# EAGLE design Video_critter_mini_v01 (EAGLE 6.1)
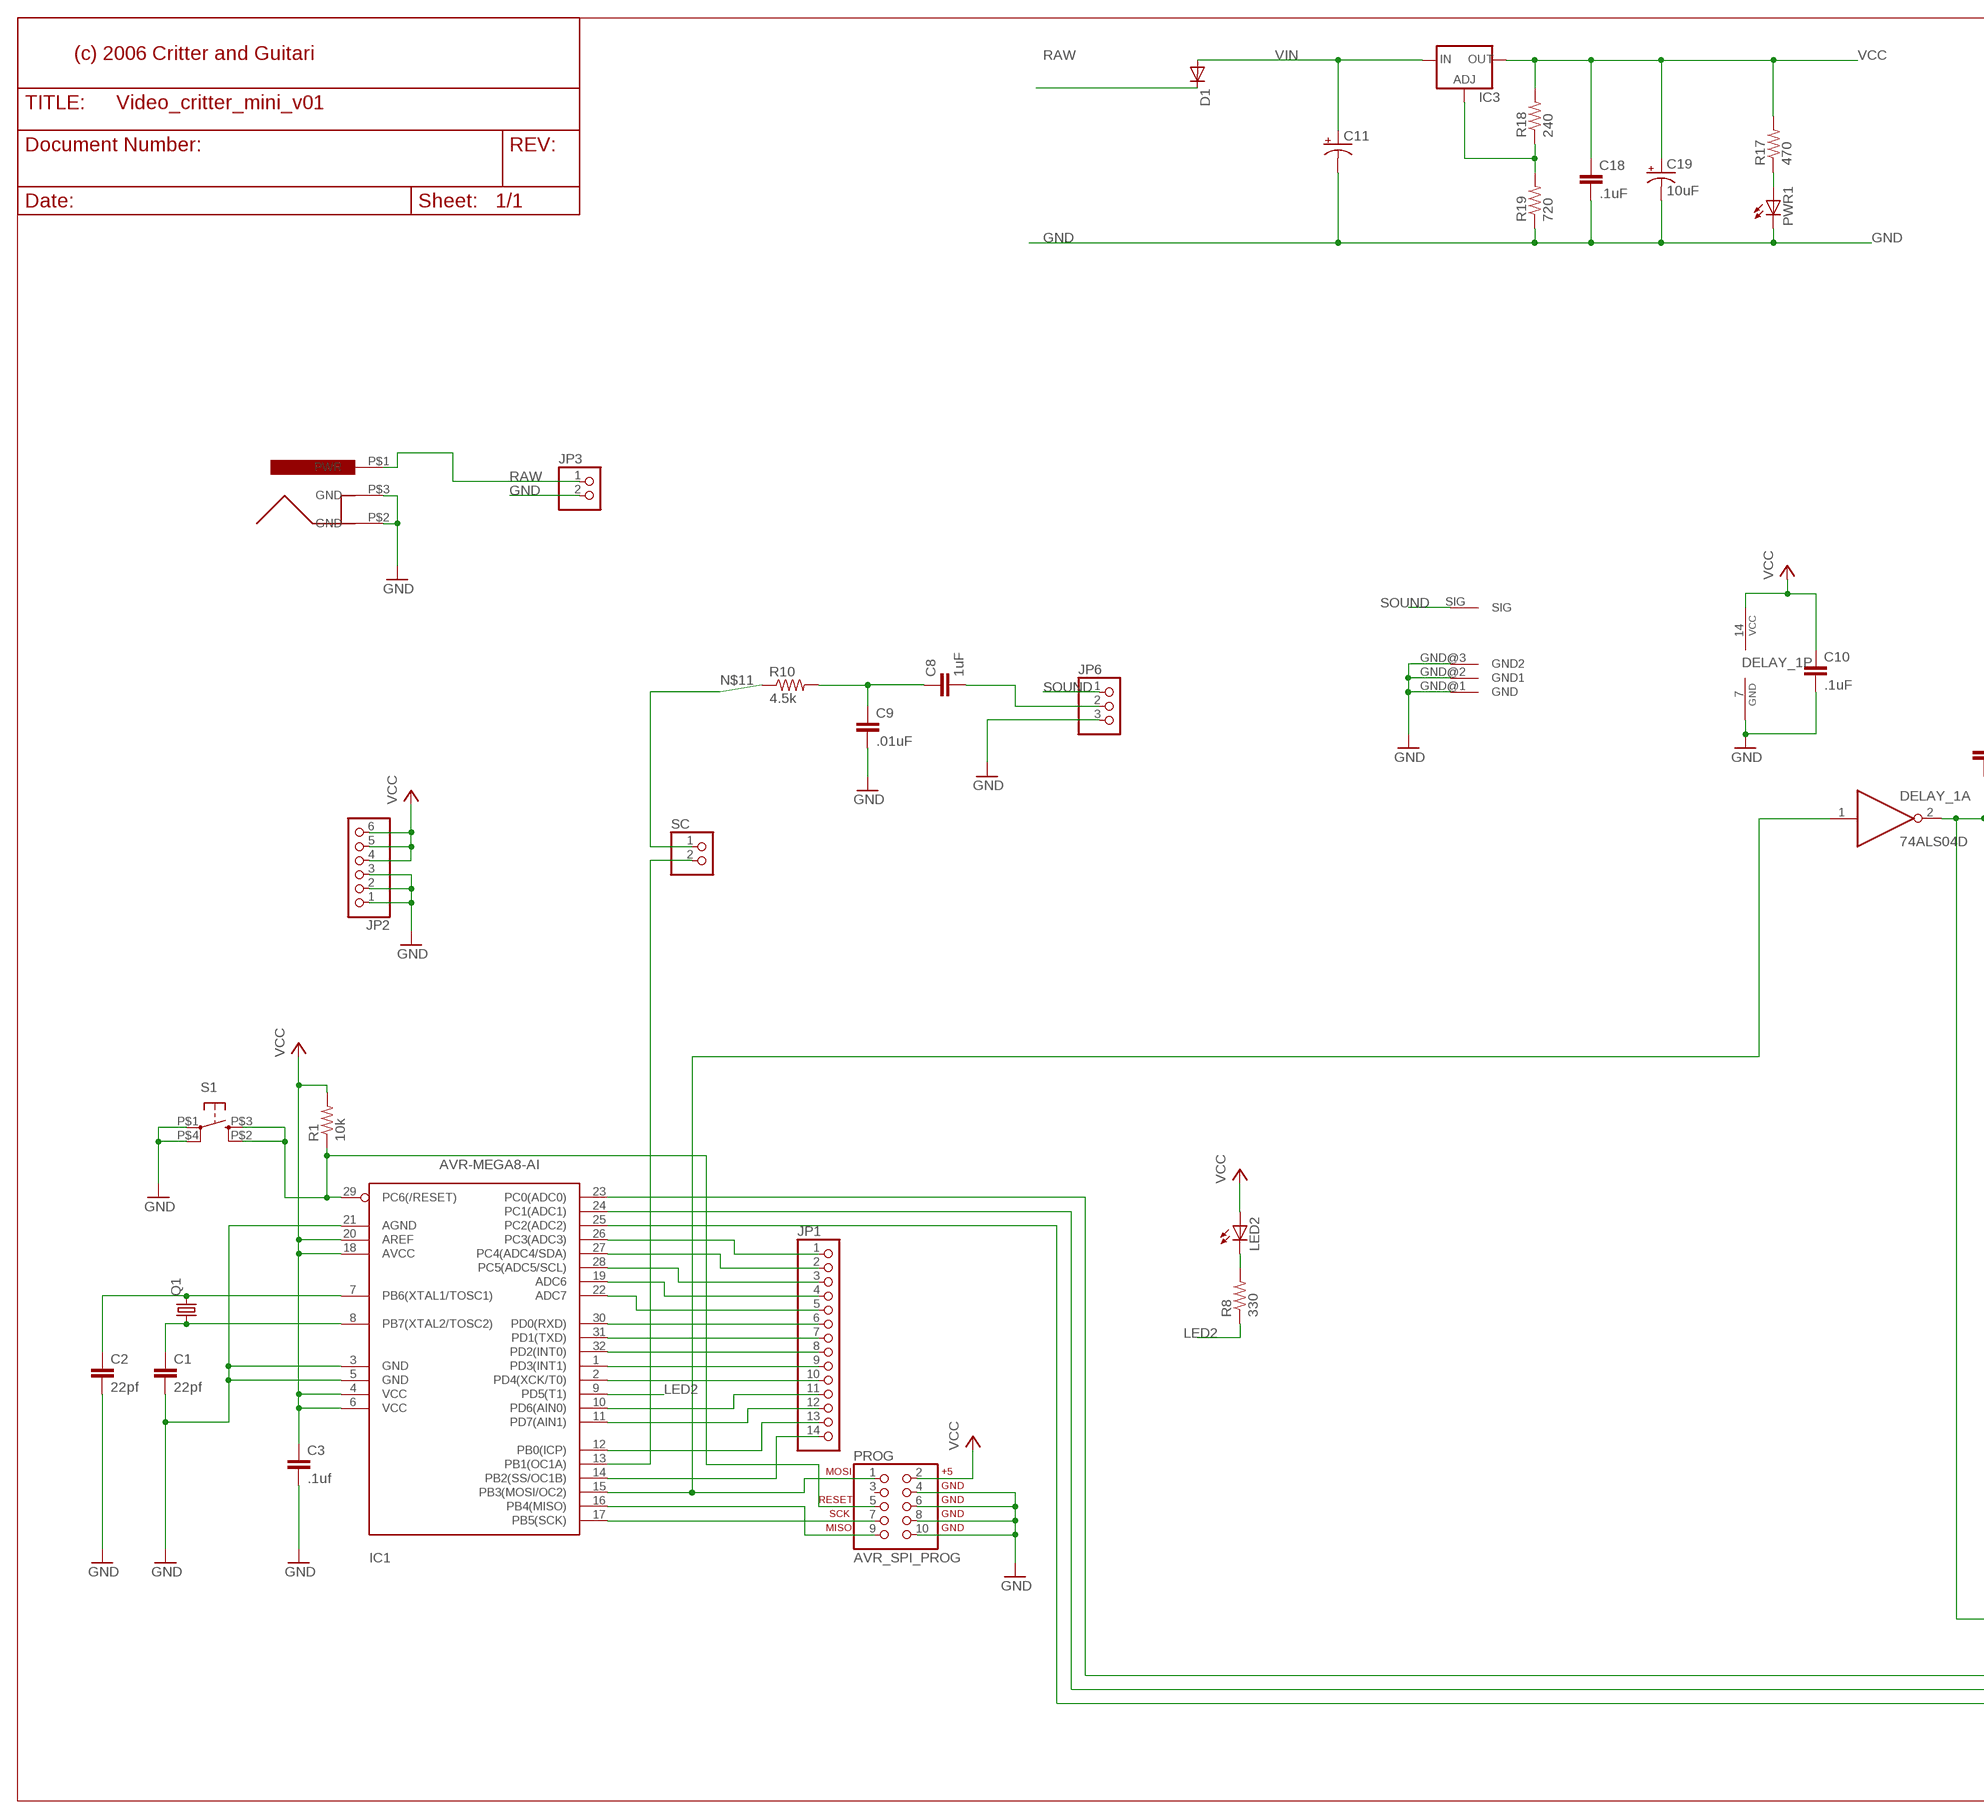
[diagram p0: schematic, sheet 1, part 1 of 2]
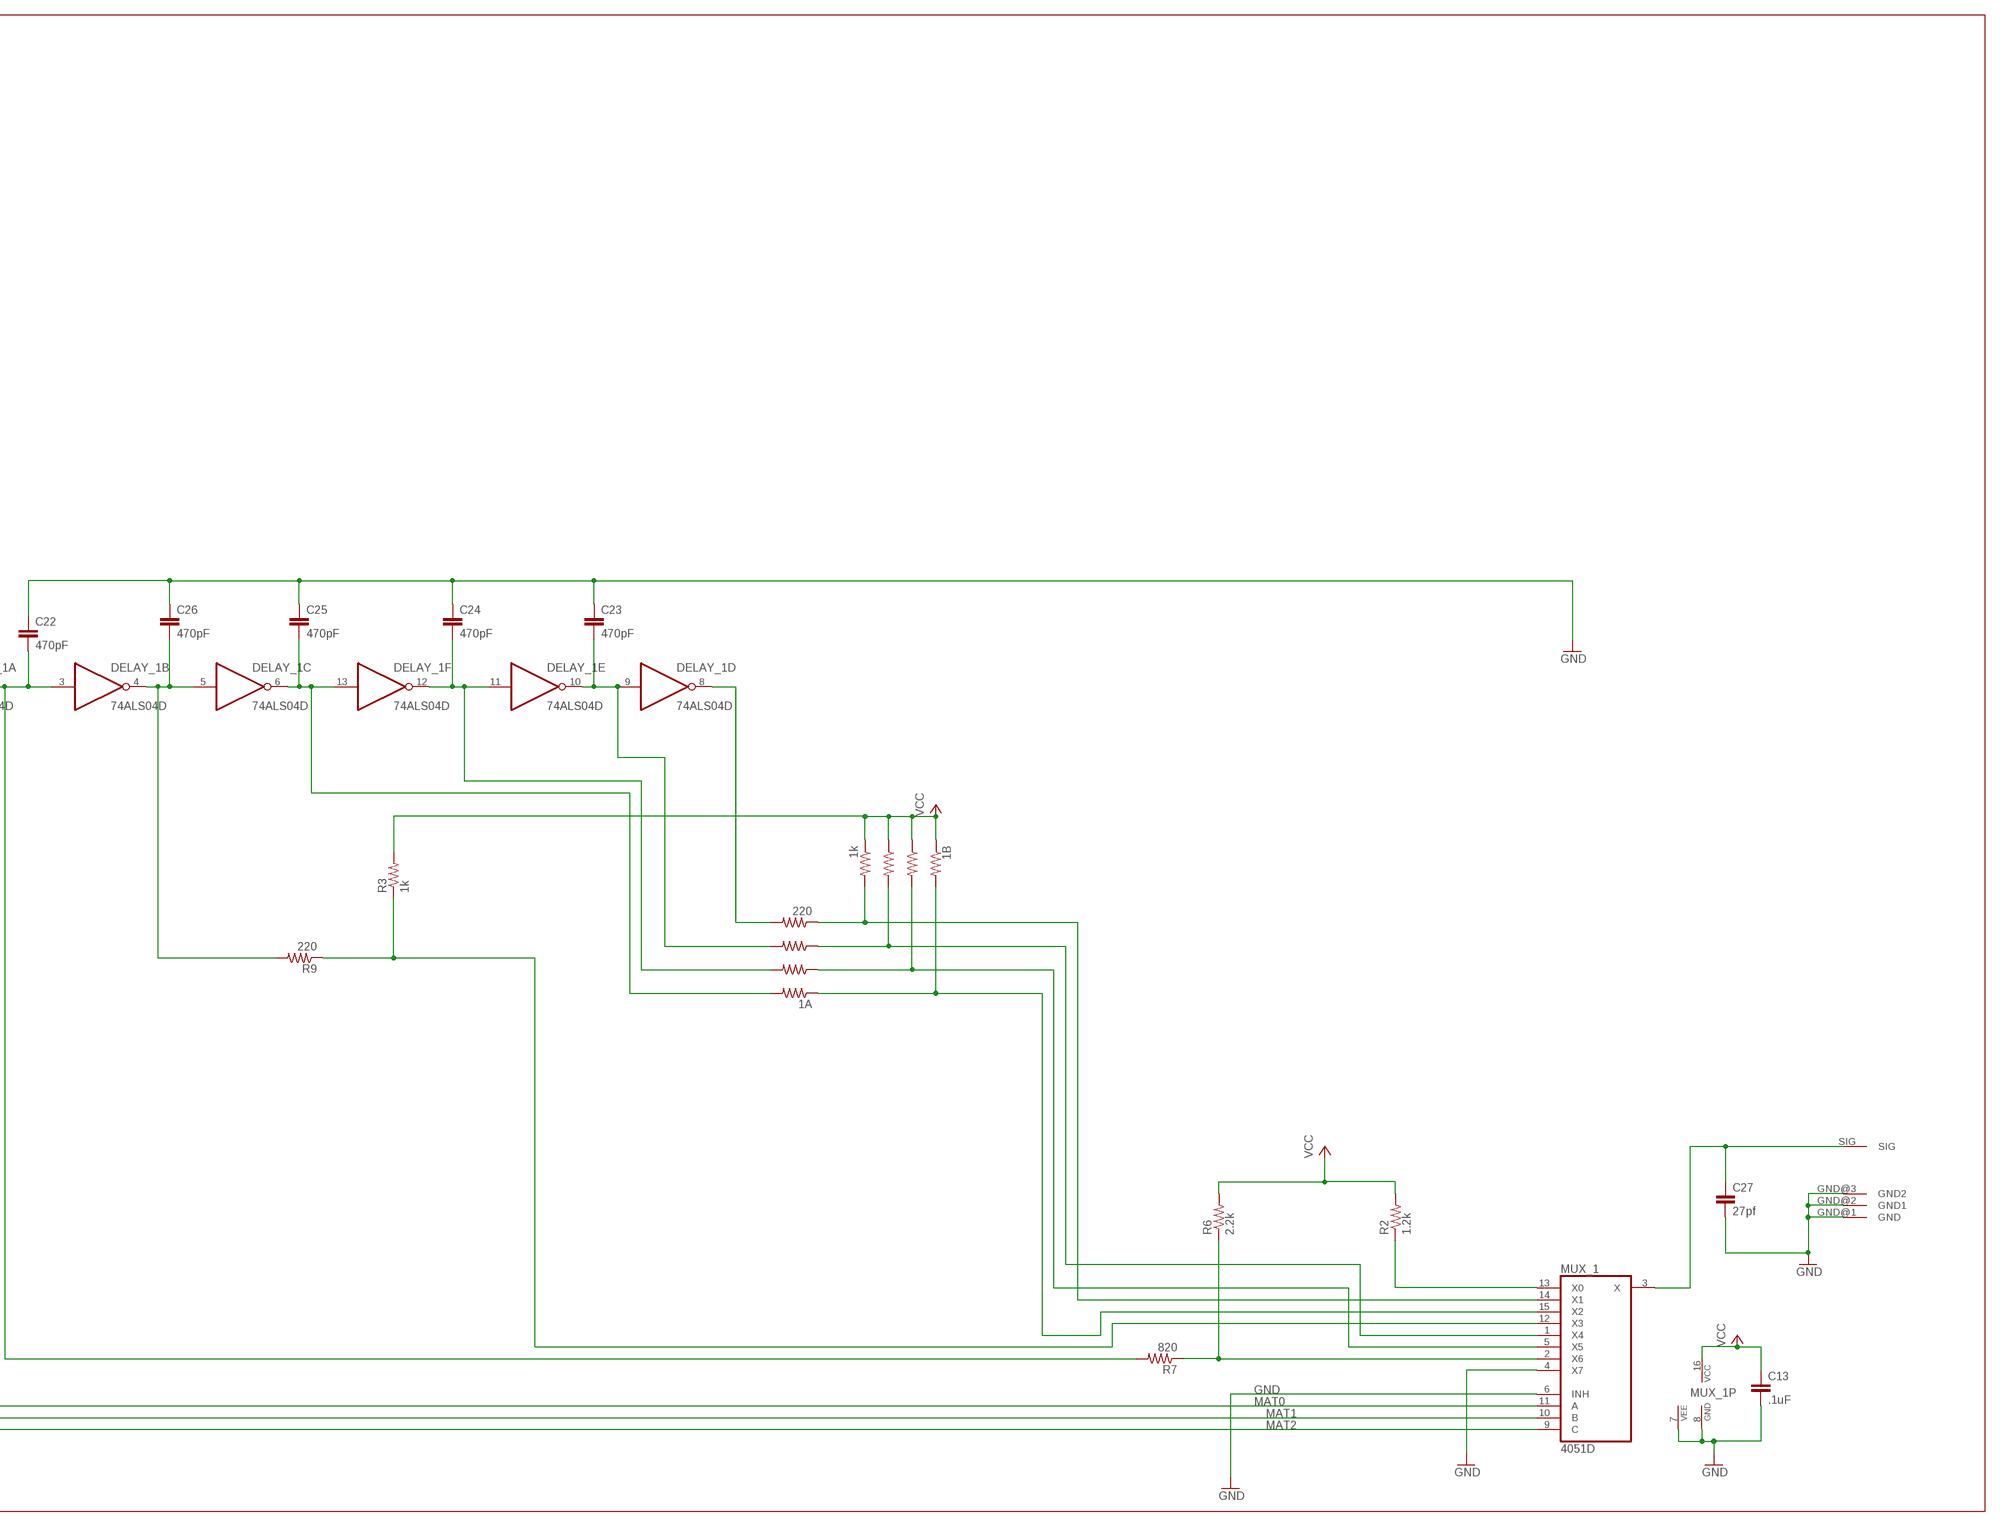
[diagram p1: schematic, sheet 1, part 2 of 2]

## Parts
1A  220  RESISTORX41206  [1206X4RESISTOR]
1B  1k  RESISTORX41206  [1206X4RESISTOR]
C1  22pf  CAP0603  [C0603]
C2  22pf  CAP0603  [C0603]
C3  .1uf  CAP0603  [C0603]
C8  1uF  CAP0603  [C0603]
C9  .01uF  CAP0603  [C0603]
C10  .1uF  CAP0603  [C0603]
C11  CPOL-USE3.5-8  [E3,5-8]
C13  .1uF  CAP0603  [C0603]
C18  .1uF  CAP0603  [C0603]
C19  10uF  CAP_POL1206  [CPOL_1206]
C22  470pF  CAP0603  [C0603]
C23  470pF  CAP0603  [C0603]
C24  470pF  CAP0603  [C0603]
C25  470pF  CAP0603  [C0603]
C26  470pF  CAP0603  [C0603]
C27  27pf  CAP0603  [C0603]
D1  DIODESMB  [SMB]
DELAY_1  74ALS04D  [SO14]
IC1  AVR-MEGA8-AI  [TQFP32-08]
IC3  V_REG_FAN1117SOT223  [SOT223]
JP1  PINHD-1X14  [1X14]
JP2  PINHD-1X6  [1X06]
JP3  PINHD-1X2  [1X02]
JP6  PINHD-1X3  [1X03]
LED2  LED1206  [CHIPLED_1206]
MUX_1  4051D  [SO16]
PROG  AVR_SPI_PROG  [PINHEAD_2X05]
PWR1  LED1206  [CHIPLED_1206]
Q1  CRYSTALHC49UV  [HC49U-V]
R1  10k  RES0603  [R0603]
R2  1.2k  RES0603  [R0603]
R3  1k  RES0603  [R0603]
R6  2.2k  RES0603  [R0603]
R7  820  RES0603  [R0603]
R8  330  RES0603  [R0603]
R9  220  RES0603  [R0603]
R10  4.5k  RES0603  [R0603]
R17  470  RES0603  [R0603]
R18  240  RES0603  [R0603]
R19  720  RES0603  [R0603]
S1  TAC_SWITCH  [TACTILE_SWITCH_SMD]
SC  PINHD-1X2  [1X02]
U$1  POWER_JACK  POWER_JACKTHRU-HOLE  [POWER_JACK]
U$5  PHONO_PLUG  [PHONO_PCB]
U$6  PHONO_PLUG  [PHONO_PCB]

## Nets
BURST: C22.2 DELAY_1.2(A:O) DELAY_1.3(B:I) R7.2
COLORS: DELAY_1.1(A:I) IC1.15(PB3(MOSI/OC2)) PROG.1
GND [power]: C1.2 C2.2 C3.2 C9.2 C10.2 C11.- C13.2 C18.2 C19.C(-) C22.1 C23.1 C24.1 C25.1 C26.1 C27.2 DELAY_1.7(P:GND) IC1.3(GND) IC1.5(GND) IC1.21(AGND) JP2.1 JP2.2 JP2.3 JP3.2 JP6.3 MUX_1.4(X7) MUX_1.6(INH) MUX_1.7(VEE) MUX_1.8(GND) PROG.4 PROG.6 PROG.8 PROG.10 PWR1.C R19.1 S1.P$1(P) S1.P$4(P1) U$1.P$2(GND) U$1.P$3(GND) U$5.GND@1(GND) U$5.GND@2(GND1) U$5.GND@3(GND2) U$6.GND@1(GND) U$6.GND@2(GND1) U$6.GND@3(GND2)
LED2: IC1.9(PD5(T1)) R8.1
MAT0: IC1.23(PC0(ADC0)) MUX_1.11(A)
MAT1: IC1.24(PC1(ADC1)) MUX_1.10(B)
MAT2: IC1.25(PC2(ADC2)) MUX_1.9(C)
N$1: IC1.13(PB1(OC1A)) SC.2
N$2: 1A.P$2 DELAY_1.8(D:O)
N$3: 1A.P$4 C23.2 DELAY_1.9(D:I) DELAY_1.10(E:O)
N$4: C2.1 IC1.7(PB6(XTAL1/TOSC1)) Q1.2
N$5: C1.1 IC1.8(PB7(XTAL2/TOSC2)) Q1.1
N$6: C8.1 C9.1 R10.2
N$7: C26.2 DELAY_1.4(B:O) DELAY_1.5(C:I) R9.2
N$8: MUX_1.12(X3) R3.1 R9.1
N$9: C8.2 JP6.2
N$10 [power]: IC1.29(PC6(/RESET)) PROG.5 R1.1 S1.P$2(S1) S1.P$3(S)
N$11: R10.1 SC.1
N$12: IC1.26(PC3(ADC3)) JP1.1
N$13: IC3.1(ADJ) R18.1 R19.2
N$14: IC1.27(PC4(ADC4/SDA)) JP1.2
N$15: IC1.28(PC5(ADC5/SCL)) JP1.3
N$16: IC1.17(PB5(SCK)) PROG.7
N$17: IC1.16(PB4(MISO)) PROG.9
N$18: IC1.19(ADC6) JP1.4
N$19: IC1.22(ADC7) JP1.5
N$20: IC1.30(PD0(RXD)) JP1.6
N$21: LED2.C R8.2
N$22: IC1.31(PD1(TXD)) JP1.7
N$23: IC1.32(PD2(INT0)) JP1.8
N$24: PWR1.A R17.1
N$25: IC1.1(PD3(INT1)) JP1.9
N$26: IC1.2(PD4(XCK/T0)) JP1.10
N$27: IC1.10(PD6(AIN0)) JP1.11
N$28: IC1.11(PD7(AIN1)) JP1.12
N$29: IC1.12(PB0(ICP)) JP1.13
N$30: IC1.14(PB2(SS/OC1B)) JP1.14
N$31: 1A.P$8 C25.2 DELAY_1.6(C:O) DELAY_1.13(F:I)
N$32: 1A.P$6 C24.2 DELAY_1.11(E:I) DELAY_1.12(F:O)
N$33: MUX_1.13(X0) R2.1
N$41: 1A.P$1 1B.P$2 MUX_1.14(X1)
N$42: 1A.P$3 1B.P$4 MUX_1.1(X4)
N$43: 1A.P$5 1B.P$6 MUX_1.5(X5)
N$44: 1A.P$7 1B.P$8 MUX_1.15(X2)
N$51: C27.1 MUX_1.3(X) U$6.SIG
N$55: MUX_1.2(X6) R6.1 R7.1
RAW: D1.1(C) JP3.1 U$1.P$1(PWR)
SOUND: JP6.1 U$5.SIG
VCC [power]: 1B.P$1 1B.P$3 1B.P$5 1B.P$7 C3.1 C10.1 C13.1 C18.1 C19.A(+) DELAY_1.14(P:VCC) IC1.4(VCC) IC1.6(VCC) IC1.18(AVCC) IC1.20(AREF) IC3.2(OUT) JP2.4 JP2.5 JP2.6 LED2.A MUX_1.16(VCC) PROG.2 R1.2 R2.2 R3.2 R6.2 R17.2 R18.2
VIN [power]: C11.+ D1.2(A) IC3.3(IN)
Unconnected: PROG.3

## Notes on the sheet
- (c) 2006 Critter and Guitari

## Library data of the parts
1A 1B = SparkFun:RESISTORX4
C1-C3 C8-C10 C13 C18 C22-C27 = SparkFun:CAP: CAPACITOR
C11 = rcl:CPOL-US: POLARIZED CAPACITOR, American symbol
C19 = SparkFun:CAP_POL
D1 = SparkFun:DIODE
DELAY_1 = 74xx-us:74*04: Hex INVERTER
IC1 = SparkFun:AVR-MEGA8: MICROCONTROLLER 8 Kbytes FLASH 1 kbytes SRAM 512 bytes EEPROM USART 6-channel 10 bit ADC 2-channel 8 bit ADC
IC3 = SparkFun:V_REG_FAN1117: VOLTAGE REGULATOR
JP1 = pinhead:PINHD-1X14: PIN HEADER
JP2 = pinhead:PINHD-1X6: PIN HEADER
JP3 SC = pinhead:PINHD-1X2: PIN HEADER
JP6 = pinhead:PINHD-1X3: PIN HEADER
LED2 PWR1 = SparkFun:LED
MUX_1 = 40xx:4051: 8-channel ANALOG MULTIPLEXER
PROG = SparkFun:AVR_SPI_PROG: PIN HEADER
Q1 = SparkFun:CRYSTAL
R1-R3 R6-R10 R17-R19 = SparkFun:RES: RESISTOR
S1 = SparkFun:TAC_SWITCH: OMRON SWITCH
U$1 = SparkFun:POWER_JACK
U$5 U$6 = sfe_owen:PHONO_PLUG

## Net classes
0 default: width 0.254 mm
1 power: width 0.254 mm

## Board
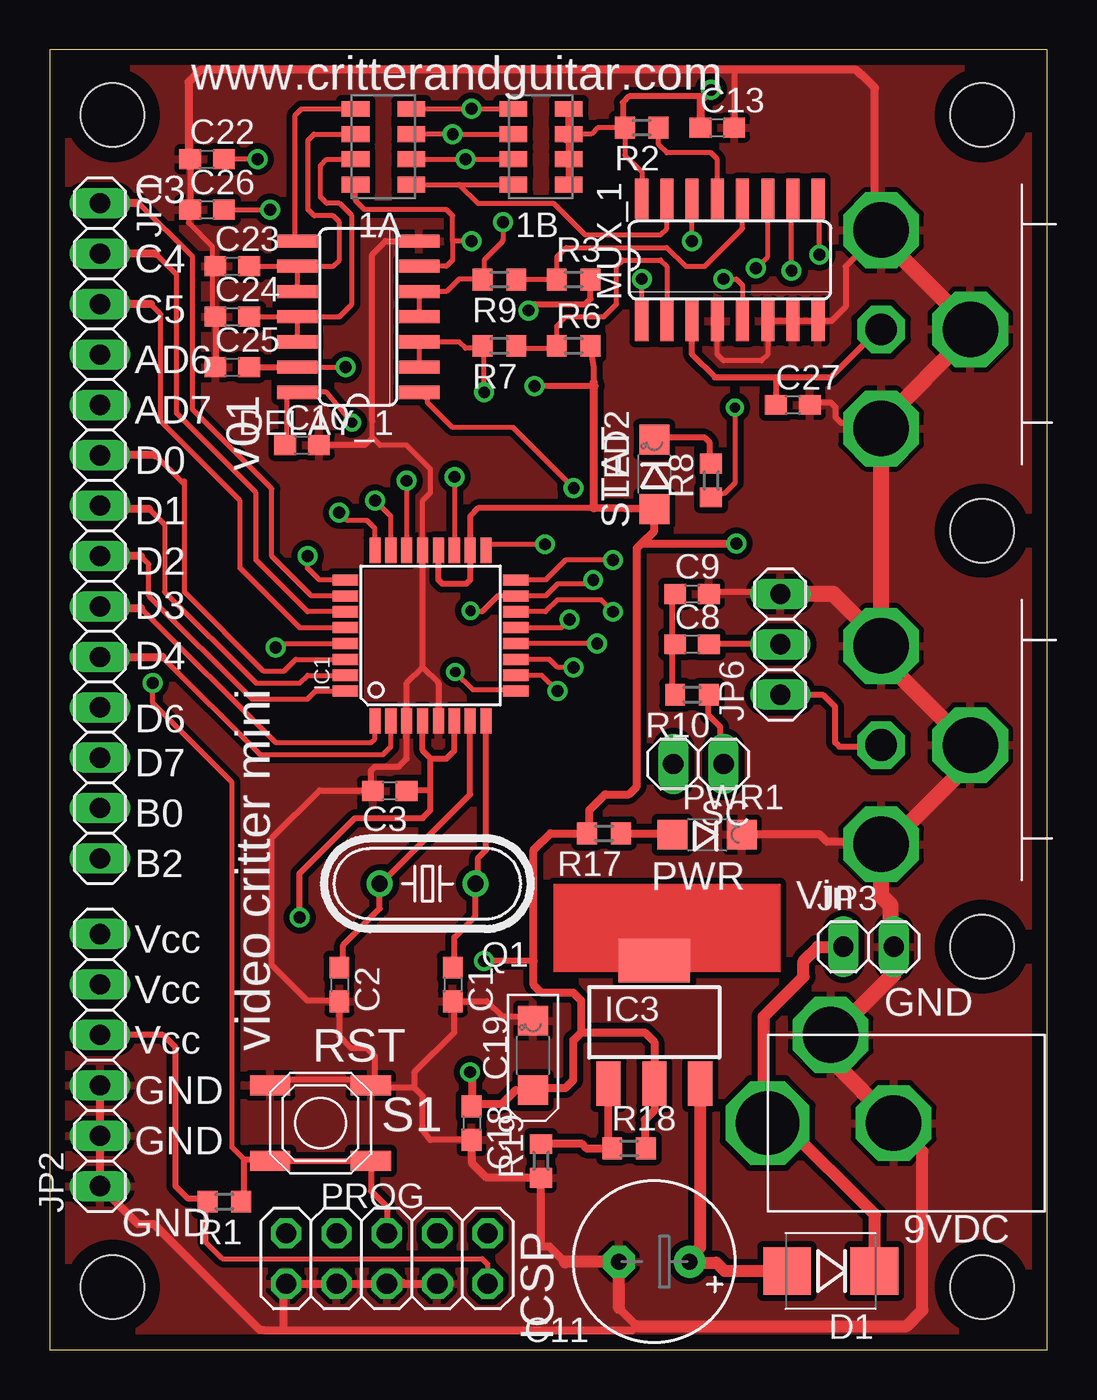
[diagram p2: board, top side]
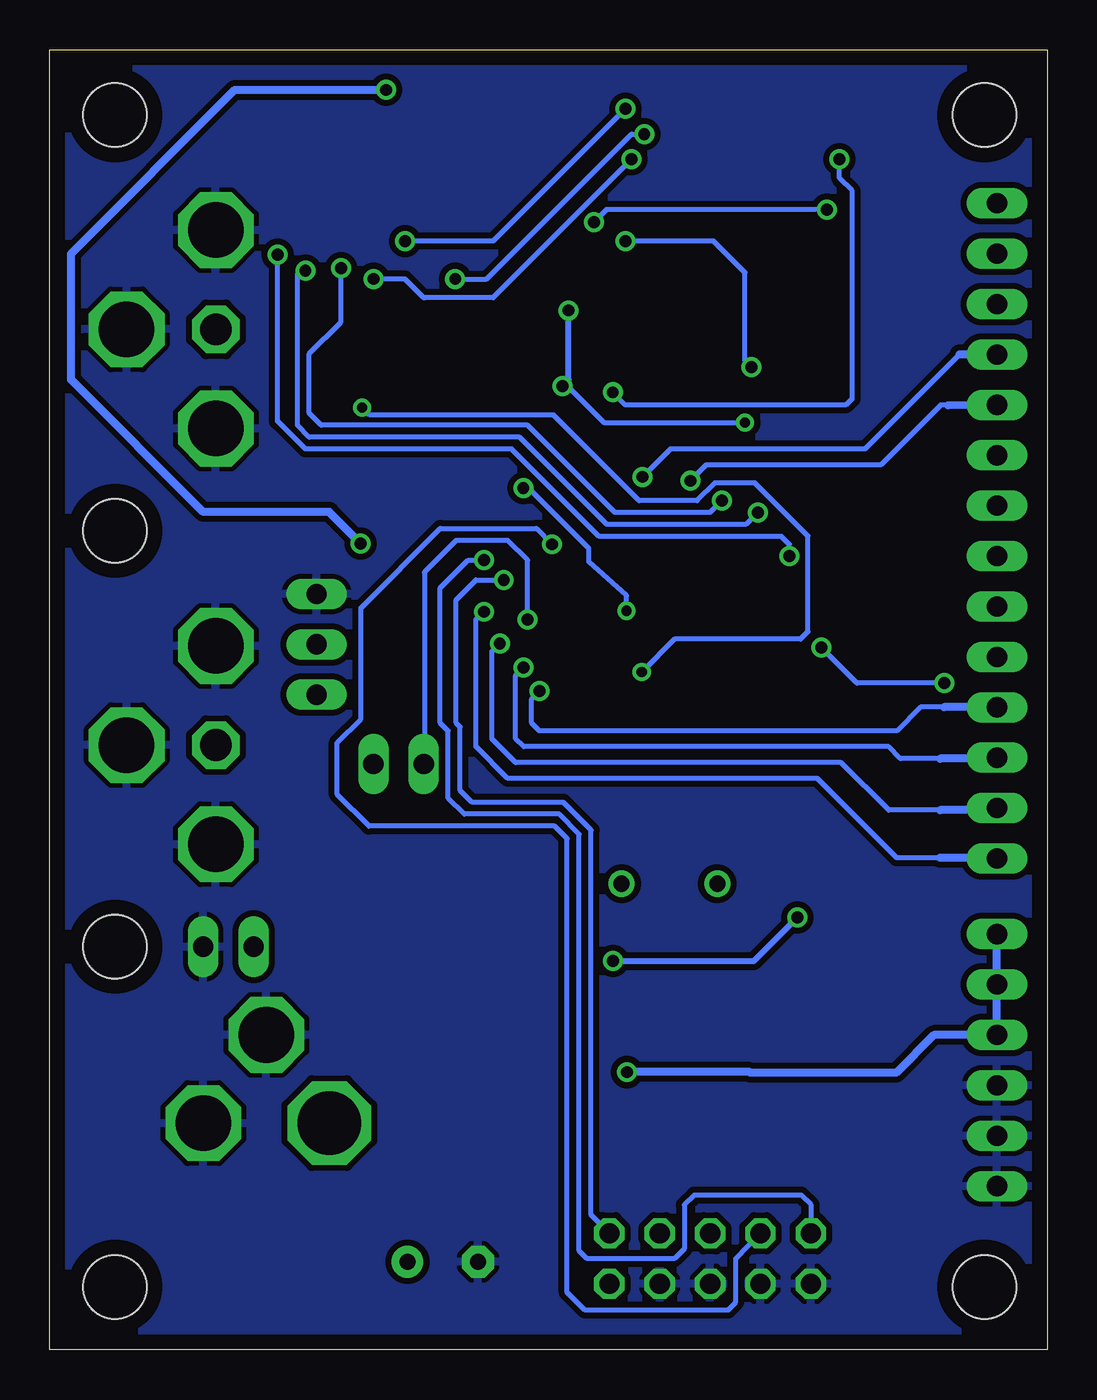
[diagram p3: board, bottom side, seen from below]

Size 50.29 x 65.53 mm. Coordinates in mm from the lower left corner, seen from the top.
Outline: 0,0 50.29,0 50.29,65.53 0,65.53 0,0
Copper layers (1*16): Top 0.0356mm / dielectric 1.5011mm / Bottom 0.0356mm
Design rules: minimum track width 10mil, minimum drill 20mil, track to track 10mil, track to pad 10mil, pad to pad 10mil, via to via 10mil, smd to smd 10mil, copper to edge 30mil, drill to drill 8mil, minimum pad ring 10mil, minimum via ring 8mil, stop-mask expansion 4mil, vias tented up to drill 0mil, thermal gap 10mil
Holes 3.2 mm at 46.99,3.17 46.99,20.32 46.99,41.27 46.99,62.23 3.17,62.23 3.17,3.17

### Footprints (pad centres in the part's own frame; a part is rotated, then mirrored left to right if it is on the bottom)
1206X4RESISTOR = smd 1.4 x 0.8: P$1 -1.4,-1.9; P$2 1.4,-1.9; P$3 -1.4,-0.63; P$4 1.4,-0.63; P$5 -1.4,0.64; P$6 1.4,0.64; P$7 -1.4,1.91; P$8 1.4,1.91
C0603 = smd 1.1 x 1: 1 -0.85,0; 2 0.85,0
E3,5-8 = drill 0.813 pad 1.6: + -1.778,0 | drill 0.813 pad 1.6 octagon: - 1.778,0
CPOL_1206 = smd 1.5 x 1.5: A 0,-1.75; C 0,1.75
SMB = smd 2.4 x 2.4: 1 -2.2,0; 2 2.2,0
SO14 = smd 0.66 x 2.032: 1 -3.81,-3.073; 2 -2.54,-3.073; 3 -1.27,-3.073; 4 0,-3.073; 5 1.27,-3.073; 6 2.54,-3.073; 7 3.81,-3.073; 8 3.81,3.073; 9 2.54,3.073; 10 1.27,3.073; 11 0,3.073; 12 -1.27,3.073; 13 -2.54,3.073; 14 -3.81,3.073
TQFP32-08 = smd 1.27 x 0.559: 1 -4.293,2.8; 2 -4.293,2; 3 -4.293,1.2; 4 -4.293,0.4; 5 -4.293,-0.4; 6 -4.293,-1.2; 7 -4.293,-2; 8 -4.293,-2.8; 17 4.293,-2.8; 18 4.293,-2; 19 4.293,-1.2; 20 4.293,-0.4; 21 4.293,0.4; 22 4.293,1.2; 23 4.293,2; 24 4.293,2.8 | smd 0.559 x 1.27: 9 -2.8,-4.293; 10 -2,-4.293; 11 -1.2,-4.293; 12 -0.4,-4.293; 13 0.4,-4.293; 14 1.2,-4.293; 15 2,-4.293; 16 2.8,-4.293; 25 2.8,4.293; 26 2,4.293; 27 1.2,4.293; 28 0.4,4.293; 29 -0.4,4.293; 30 -1.2,4.293; 31 -2,4.293; 32 -2.8,4.293
SOT223 = smd 1.219 x 2.235: 1 -2.311,-3.099; 2 0,-3.099; 3 2.311,-3.099 | smd 3.6 x 2.2: 4 0,3.099
1X14 = drill 1.016 long: 1 -16.51,0; 2 -13.97,0; 3 -11.43,0; 4 -8.89,0; 5 -6.35,0; 6 -3.81,0; 7 -1.27,0; 8 1.27,0; 9 3.81,0; 10 6.35,0; 11 8.89,0; 12 11.43,0; 13 13.97,0; 14 16.51,0
1X06 = drill 1.016 long: 1 -6.35,0; 2 -3.81,0; 3 -1.27,0; 4 1.27,0; 5 3.81,0; 6 6.35,0
1X02 = drill 1.016 long: 1 -1.27,0; 2 1.27,0
1X03 = drill 1.016 long: 1 -2.54,0; 2 0,0; 3 2.54,0
CHIPLED_1206 = smd 1.5 x 1.5: A 0,-1.75; C 0,1.75
SO16 = smd 0.66 x 2.032: 1 -4.445,-3.073; 2 -3.175,-3.073; 3 -1.905,-3.073; 4 -0.635,-3.073; 5 0.635,-3.073; 6 1.905,-3.073; 7 3.175,-3.073; 8 4.445,-3.073; 9 4.445,3.073; 10 3.175,3.073; 11 1.905,3.073; 12 0.635,3.073; 13 -0.635,3.073; 14 -1.905,3.073; 15 -3.175,3.073; 16 -4.445,3.073
PINHEAD_2X05 = drill 1.016 octagon: 1 -1.27,5.08; 2 1.27,5.08; 3 -1.27,2.54; 4 1.27,2.54; 5 -1.27,0; 6 1.27,0; 7 -1.27,-2.54; 8 1.27,-2.54; 9 -1.27,-5.08; 10 1.27,-5.08
HC49U-V = drill 0.813: 1 -2.413,0; 2 2.413,0
R0603 = smd 1 x 1.1: 1 -0.85,0; 2 0.85,0
TACTILE_SWITCH_SMD = smd 2.032 x 1.016: P$1 -2.54,1.905; P$2 -2.54,-1.905; P$3 2.54,-1.905; P$4 2.54,1.905
POWER_JACK = drill 3.2 octagon: P$1 0,4.445 | drill 2.8 octagon: P$2 3.175,8.89; P$3 6.35,4.445
PHONO_PCB = drill 2.8 octagon: GND@1 0,5; GND@2 0,-5; GND@3 4.5,0 | drill 1.6 octagon: SIG 0,0

### Placement (x,y rotation side)
1A  16.83,60.64 180 top
1B  24.77,60.64 180 top
C1  20.32,18.41 270 top
C2  14.61,18.41 270 top
C3  17.14,28.18 180 top
C8  32.38,35.56 0 top
C9  32.38,38.1 0 top
C10  12.72,45.6 0 top
C11  30.48,4.45 180 top
C13  33.66,61.59 0 top
C18  21.27,11.43 270 top
C19  24.36,14.84 0 top
C22  7.94,60.01 0 top
C23  9.21,54.61 0 top
C24  9.21,52.07 0 top
C25  9.21,49.53 0 top
C26  7.94,57.47 0 top
C27  37.47,47.62 0 top
D1  39.37,3.98 180 top
DELAY_1  15.56,52.07 90 top
IC1  19.2,36 90 top
IC3  30.48,16.51 0 top
JP1  2.54,41.27 270 top
JP2  2.54,14.61 90 top
JP3  41.27,20.32 0 top
JP6  36.83,35.56 90 top
LED2  30.48,44.13 0 top
MUX_1  34.29,54.93 0 top
PROG  17,4.6 270 top
PWR1  33.15,25.96 270 top
Q1  19.05,23.5 180 top
R1  8.81,7.47 180 top
R2  29.84,61.59 180 top
R3  26.41,53.94 0 top
R6  26.41,50.6 0 top
R7  22.67,50.6 180 top
R8  33.34,43.81 90 top
R9  22.67,53.94 180 top
R10  32.38,33.02 180 top
R17  27.94,26.04 180 top
R18  29.21,10.16 0 top
R19  24.77,9.53 90 top
S1  13.65,11.43 0 top
SC  32.7,29.53 180 top
U$1  36.2,6.99 0 top
U$5  41.91,30.48 0 top
U$6  41.91,51.44 0 top

### Tracks (layer width: path | path; a pad name or v marks a point on that pad's centre or on a via)
BURST  (via drill 0.6)
  Top 0.254: DELAY_1.2 18.73,49.53 18.63,49.63 DELAY_1.3 20.64,50.8 20.95,50.48 21.91,50.48 | v10.48,60.01 C22.2 | 21.91,50.48 21.82,50.57 R7.2 | v21.91,48.26 21.91,50.48
  Bottom 0.254: v10.48,60.01 10.48,59.05 9.84,58.42 9.84,47.94 10.16,47.62 21.27,47.62 v21.91,48.26
COLORS  (via drill 0.51, 0.6)
  Top 0.254: v26.42,43.43 23.37,46.48 20.32,46.48 19.05,47.75 19.05,48.01 18.89,48.01 DELAY_1.1 | 21.21,37.21 21.2,37.2 | 21.21,37.21 v21.21,37.25 | 23.4,38 IC1.15 | 21.41,37.21 21.79,37.21 21.8,37.2 22.59,38.01 23.4,38 | 21.41,37.21 21.21,37.21 | 21.41,37.21 21.81,37.21 22.6,38 23.4,38 | 23.4,38 25,38 25.6,38.6 27.2,38.6 v27.4,38.8
  Bottom 0.254: v21.21,37.25 21.21,38.01 23.11,39.72 23.11,40.39 26.16,43.43 v26.42,43.43 | v27.4,38.8 28.8,38.8 29.8,37.8 29.8,31.6 29.6,31.4 29.6,28.2 29,27.6 24.4,27.6 23,26.2 23,6.8 PROG.1 | PROG.1 22,5.8 | PROG.1
GND
  Top 0.254: C24.1 8.2,52.23 8.2,54.4 | 8.2,54.4 8.2,54.6 8.35,54.6 C23.1 8.2,54.45 8.2,54.4 | 8.2,54.4 8.2,55.6 7,56.8 7,57.38 C26.1 7,57.55 | 7,60 C22.1 | IC1.21 18.8,42.8 19.2,43.2 19.2,44.4 18,45.6 16.65,45.6 16.27,45.99 16.25,46 16.25,46.8 | MUX_1.4 33.66,50.16 33.97,49.85 35.88,49.85 36.2,50.16 MUX_1.6 36.2,52.07
  Top 0.305: DELAY_1.7 16.93,55.88 16.25,55.2 16.25,46.8 | 18.8,40 IC1.21 18.8,34.4 | 18.8,34.4 19.6,33.6 IC1.5 | 18.8,34.4 18,33.6 IC1.3 18,29.8 17.6,29.4 16.4,29.4 16.2,29.2 16.2,28.6 16.27,28.2 | 16.14,13.34 16,13.2 | 16.14,13.34 S1.P$4 | 16.4,13.6 16.4,14.8 16,15.2 15.2,15.2 14.61,15.79 C2.2 14.6,17.6 13,17.6 11.2,19.4 11.2,25.8 13.6,28.2 16.27,28.2 | 16.4,13.6 16.14,13.34 | S1.P$1 11.11,13.29 11.2,13.2 11.6,13.6 16.4,13.6 | 16.4,13.6 16.8,13.2 18.4,13.2 | 18.4,13.2 18.8,12.8 18.8,11.1 19.18,10.58 C18.2 | 18.4,13.2 18.4,14 20.4,16 20.4,17.6 20.36,17.57 C1.2 22.04,17.57 22.8,16.8 24.4,16.8 24.43,16.84 24.43,17.16 24.8,17.2 24.77,17.16 C19.C | JP6.3 36.8,38.13 36.8,38.2 33.34,38.2 C9.2 | 16.27,28.2 C3.2 | 29.4,1 29.6,1.2 | C10.2 15.88,45.6 16.27,45.99 | 8.38,49.53 8.64,49.28 | 8.38,49.53 C25.1 | C24.1 8.36,49.55 8.38,49.53 | 41.91,46.71 39.9,46.71 39.62,46.99 39.62,47.5 39.37,47.75 38.35,47.75 38.31,47.71 C27.2 | 41.91,56.39 40.13,54.61 40.13,52.58 39.41,51.85 MUX_1.8 MUX_1.7 | MUX_1.7 37.38,51.85 37.34,51.82 | MUX_1.7 MUX_1.6 36.11,51.85 36.07,51.82 | C13.2 34.51,64.48 34.54,64.52 | 6.92,57.47 6.86,57.4 | 6.92,57.47 C26.1 | C22.1 7.09,57.63 6.92,57.47
  Top 0.406: 25.95,4.45 25.2,5.2 24.8,5.2 24.77,5.24 R19.1 22.02,8.68 21.3,9.4 21.3,10.5 21.22,10.58 | 29.6,1.2 28.7,2.1 | 40.92,64.28 41.6,63.6 41.6,56.8 41.97,56.44 | 40.92,64.28 40.8,64.4 | 41.97,56.44 42,56.4 | U$6.GND@1 41.97,56.44 | PWR1.C 38.84,25.96 39.2,25.6 42,25.6 41.91,25.51 U$5.GND@2 | 11.8,1 29.4,1 | 7,60 7,63.9 7.62,64.52 34.54,64.52 40.64,64.52 40.89,64.26 40.92,64.28 | 11.8,3.32 12.4,3.4 | 11.8,3.32 PROG.10 15,3.32 | 10.79,1 11.8,1 | 10.79,1 10.6,1 | 11.8,1 11.8,3.32 | 15,3.32 PROG.8 PROG.6 | 15,3.32 15,3.2 | PROG.6 17.8,3.32 17.8,3.4 | 20.2,3.32 PROG.4 | PROG.6 20.2,3.32 | 20.2,3.32 20.2,3.4 | 21.22,10.58 21.2,10.6 | 21.22,10.58 C18.2 | JP2.1 JP2.2 JP2.3 JP2.1 | JP2.1 4.45,6.35 5.24,6.35 10.48,1.11 10.79,1
  Top 0.61: 28.7,2.1 C11.- 26.05,4.45 26,4.4 25.95,4.45 | 29.6,1.2 43.2,1.2 44,2 44,10 42.57,11.43 U$1.P$3
  Top 0.813: 46.56,51.44 46.8,51.2 | 46.56,51.44 U$6.GND@3 46.41,51.21 41.91,46.71 | U$6.GND@1 41.91,56.39 41.91,56.09 46.56,51.44 | 41.91,46.71 U$6.GND@2 | U$5.GND@1 41.72,35.48 41.6,35.6 41.91,35.91 41.91,46.71 | U$5.GND@1 41.91,35.51 42,35.6 39.5,38.1 JP6.3 | U$5.GND@1 41.91,34.89 46.4,30.4 46.41,30.41 U$5.GND@3 46.41,29.61 42,25.2 41.91,25.29 U$5.GND@2 41.91,22.89 42.4,22.4 42.4,21.2 42.8,20.8 42.8,20.4 42.55,20.14 | 42.55,20.14 42.4,20 | 42.55,20.14 JP3.2 42.55,18.95 39.48,15.88 U$1.P$2 39.37,14.63 42.55,11.46 U$1.P$3
  pour Top (isolate 0.305): -1.27,67.31 52.07,67.31 52.07,-2.29 51.82,-2.54 -1.27,-2.54
  pour Bottom (isolate 0.305): -1.27,66.04 53.34,66.04 53.34,-3.56 53.09,-3.81 -1.27,-3.81 -1.27,65.79 -1.02,66.04 0,66.04
LED2  (via drill 0.51)
  Top 0.254: v34.54,47.5 34.54,43.69 34.04,43.18 R8.1 | v20.45,34.16 21.34,33.27 23.37,33.27 IC1.9
  Bottom 0.254: v34.54,47.5 34.16,47.12 24.89,47.12 20.57,42.8 17.65,42.8 16.76,43.69 14.73,43.69 12.06,41.02 12.06,36.2 12.45,35.81 18.8,35.81 v20.45,34.16
MAT0  (via drill 0.6)
  Top 0.254: IC1.23 17.2,42 v16.4,42.8 | MUX_1.11 36.2,55.11 v35.6,54.51
  Bottom 0.254: v16.4,42.8 17,42.2 21.8,42.2 26.2,46.6 36.6,46.6 37.2,47.2 37.2,50.2 35.6,51.8 v35.6,54.51
MAT1  (via drill 0.6)
  Top 0.254: IC1.24 16.4,41.4 16,41.8 15,41.8 v14.6,42.2 | MUX_1.10 37.4,58 v37.4,54.4
  Bottom 0.254: v14.6,42.2 15.2,41.6 22.2,41.6 26.6,46 37.2,46 37.8,46.6 37.8,54.2 37.6,54.4 v37.4,54.4
MAT2  (via drill 0.6)
  Top 0.254: IC1.25 13.6,38.8 13,39.4 v13,40 | 38.8,58.07 38.8,58.2 | 38.8,58.07 MUX_1.9 | v38.8,55.2 38.8,58.07
  Bottom 0.254: v13,40 13,40.6 13.4,41 22.6,41 27,45.4 37.4,45.4 38.8,46.8 v38.8,55.2
N$1  (via drill 0.6)
  Top 0.254: IC1.13 25.8,36.4 v26.2,36.8
  Bottom 0.254: v26.2,36.8 26.2,39.8 27.2,40.8 29.8,40.8 31.4,39.2 31.4,29.8 31.6,29.6 31.53,29.53 SC.2
N$2
  Top 0.254: 1A.P$2 12.7,62.54 12.38,62.23 12.38,55.88 DELAY_1.8
  Top 0.406: 12.4,56 12.48,55.92 DELAY_1.8
N$3
  Top 0.254: 1A.P$4 13.33,61.27 13.02,60.96 13.02,57.47 13.34,57.15 14.29,57.15 14.61,56.83 14.61,54.93 14.29,54.61 DELAY_1.9 | DELAY_1.10 12.7,53.34 12.48,53.56 DELAY_1.9 | 9.84,54.61 C23.2 DELAY_1.9
N$4
  Top 0.305: IC1.7 21.2,28 16.8,23.6 16.91,23.5 Q1.2 16.64,22.24 14.8,20.4 14.8,19.6 14.46,19.27 | 14.46,19.27 14.4,19.2 | C2.1 14.46,19.27
N$5
  Top 0.305: IC1.8 22,25.2 21.6,24.8 21.6,23.6 21.5,23.5 Q1.1 21.46,21.86 20.4,20.8 20.4,19.2 20.34,19.27 C1.1
N$6
  Top 0.305: R10.2 31.4,33.16 31.4,35.6 31.5,35.6 C8.1 31.4,35.7 31.4,38 31.43,38 C9.1
N$7  (via drill 0.6)
  Top 0.254: 21.91,53.98 20.64,53.98 20,53.34 DELAY_1.5 18.63,52.17 18.73,52.07 DELAY_1.4 | C26.2 v11.11,57.47 | v22.86,56.83 22.86,55.98 22.79,55.81 21.91,54.93 21.91,53.98 | 21.91,53.98 21.87,53.94 R9.2
  Bottom 0.254: v11.11,57.47 22.23,57.47 v22.86,56.83
N$8
  Top 0.254: 25.6,53.98 25.72,53.98 | 25.6,53.98 R3.1 25.56,55.09 26.04,55.56 31.11,55.56 32.07,54.61 33.02,54.61 34.92,56.52 MUX_1.12 34.92,58.1 | R9.1 23.56,53.98 25.6,53.98
N$9
  Top 0.305: JP6.2 36.8,35.59 36.8,35.6 33.27,35.6 C8.2
N$10  (via drill 0.6)
  Top 0.254: IC1.29 11.6,35.6 v11.4,35.4 | v5.2,33.6 5.2,32.6 9.2,28.6 9.2,10.2 9.8,9.6 | 11.04,9.6 S1.P$2
  Top 0.305: 11.04,9.6 9.8,9.6 9.8,7.6 9.68,7.47 R1.1 | S1.P$2 S1.P$3 | S1.P$3 16.2,9.4 | S1.P$3 16.19,8.01 17,7.2 PROG.5 16.8,6
  Bottom 0.254: v11.4,35.4 9.6,33.6 v5.2,33.6
N$11
  Top 0.305: SC.1 33.8,29.7 33.8,31.4 33.2,32 33.2,33 33.22,33 R10.1
N$12
  Top 0.254: 4.47,57.78 4.5,57.8 7.2,55.1 7.2,47.4 11.2,43.4 11.2,40 13.2,38 14.8,38 14.91,37.89 IC1.26
  Top 0.406: 4.47,57.78 JP1.1
N$13
  Top 0.406: 28.36,10.04 28.4,10 | 28.36,10.04 R18.1 27.04,10.16 26.8,10.4 24.8,10.4 R19.2 | IC3.1 28.17,10.23 28.36,10.04
N$14
  Top 0.254: 5.36,55.24 6.4,54.2 6.4,47.2 10.4,43.2 10.4,39.8 13,37.2 IC1.27 15,37.2
  Top 0.406: 5.36,55.24 JP1.2
N$15
  Top 0.254: 5.09,52.7 5.6,52.2 5.6,46.8 9.6,42.8 9.6,39.4 12.6,36.4 IC1.28 15,36.4
  Top 0.406: 5.09,52.7 JP1.3
N$16  (via drill 0.6)
  Top 0.254: IC1.17 22,40.6 v24.96,40.6
  Bottom 0.254: v24.96,40.6 25.76,41.4 30.6,41.4 34.6,37.4 34.6,31.8 35.8,30.6 35.8,28 34.2,26.4 24.84,26.4 24.2,25.77 24.2,2.9 23.3,2 16.1,2 15.7,2.4 15.7,4.6 PROG.7
N$17  (via drill 0.6)
  Top 0.254: 23.3,38.8 IC1.16 25,38.8 26,39.8 v28.4,39.8
  Bottom 0.254: v28.4,39.8 29.2,39.8 30.6,38.4 30.6,31.6 30.2,31.2 30.2,27.8 29.4,27 24.6,27 23.6,26 23.6,5 23.2,4.6 18.8,4.6 18.3,5.1 18.3,7.3 17.8,7.8 12.4,7.8 11.9,7.3 11.9,5.85 | 11.9,5.85 11.9,5.8 | PROG.9 11.9,5.85
N$18  (via drill 0.6)
  Top 0.254: 20.4,40 IC1.19 v20.4,44
  Bottom 0.254: 4.43,50.16 9.2,45.4 19,45.4 v20.4,44
  Bottom 0.406: JP1.4 4.43,50.16
N$19  (via drill 0.6)
  Top 0.254: 18,40.2 IC1.22 v18,43.8
  Bottom 0.254: 5,47.6 5,47.62 5.38,47.62 8.4,44.6 17.2,44.6 v18,43.8
  Bottom 0.406: JP1.5 5,47.6
N$20
  Top 0.254: 6.8,43.6 5.32,45.09 | 6.8,43.6 6.8,43.8 | 6.8,43.6 6.8,38.2 10.8,34.2 11.8,34.2 12.4,34.8 IC1.30
  Top 0.406: 5.32,45.09 JP1.6
N$21
  Top 0.305: R8.2 33.27,44.73 33.27,45.72 33.02,45.97 30.48,45.97 LED2.C
N$22
  Top 0.254: 15.2,34 IC1.31 13,34 12.6,33.6 10.4,33.6 5.8,38.2 5.8,41.6 5,42.4 | 2.6,42.4 2.6,42.48 JP1.7
  Top 0.406: 2.6,42.4 5,42.4
N$23
  Top 0.254: IC1.32 13.4,33.2 13,32.8 10.2,32.8 5,38 5,39.6 4.6,40 | JP1.8
  Top 0.406: 4.6,40 JP1.8
N$24
  Top 0.406: PWR1.A 31.23,25.96 31.16,26.04 R17.1
N$25
  Top 0.254: IC1.1 16.4,30.8 16.2,30.6 11.4,30.6 4.6,37.4 | 2.4,37.4 2.46,37.47 JP1.9
  Top 0.406: 2.4,37.4 4.6,37.4
N$26
  Top 0.254: 5.67,34.92 10.6,30 16.8,30 17.2,30.4 IC1.2
  Top 0.406: JP1.10 5.67,34.92
N$27  (via drill 0.6)
  Top 0.254: v25.6,33.2 24.8,34 IC1.10 23.2,34
  Bottom 0.254: v25.6,33.2 26,32.8 26,31.6 25.6,31.2 7.6,31.2 6.4,32.4 5.2,32.4 | 2.8,32.4 2.79,32.38 JP1.11
  Bottom 0.406: 2.8,32.4 5.2,32.4
N$28  (via drill 0.6)
  Top 0.254: 23.2,34.8 IC1.11 25.2,34.8 25.6,34.4 v26.4,34.4
  Bottom 0.254: v26.4,34.4 26.8,34 26.8,30.8 26.4,30.4 8,30.4 7.4,29.8 5.4,29.8 | JP1.12 2.58,29.8
  Bottom 0.406: 2.58,29.8 5.4,29.8
N$29  (via drill 0.6)
  Top 0.254: 23.2,35.6 IC1.12 v27.6,35.6
  Bottom 0.254: v27.6,35.6 28,35.2 28,30.8 26.8,29.6 10.4,29.6 8,27.2 5.4,27.2 | JP1.13 2.65,27.2
  Bottom 0.406: 2.65,27.2 5.4,27.2
N$30  (via drill 0.6)
  Top 0.254: 23.2,37.2 IC1.14 25,37.2 25.6,37.8 27.8,37.8 v28.4,37.2
  Bottom 0.254: v28.4,37.2 28.8,36.8 28.8,30.4 27.2,28.8 11.6,28.8 7.6,24.8 5.4,24.8 | 2.4,24.8 2.5,24.8 JP1.14
  Bottom 0.406: 2.5,24.8 5.4,24.8
N$31  (via drill 0.6)
  Top 0.254: 1A.P$8 15.43,57.91 15.88,57.47 20,57.47 20.32,57.15 20.32,55.88 | 18.41,54.61 DELAY_1.6 20,54.61 20.32,54.93 20.32,55.88 | v21.27,55.88 20.32,55.88 | 12.45,49.53 12.38,49.53 | DELAY_1.13 v14.92,49.53
  Top 0.305: DELAY_1.13 12.45,49.53 C25.2
  Bottom 0.254: v21.27,55.88 16.83,55.88 15.24,54.29 15.24,49.85 v14.92,49.53
N$32
  Top 0.254: 1A.P$6 13.96,60 13.65,59.69 13.65,58.1 13.97,57.78 14.61,57.78 15.24,57.15 15.24,52.7 14.61,52.07 DELAY_1.11 | DELAY_1.11 12.06,52.07 | 9.84,52.07 C24.2 DELAY_1.11 | DELAY_1.12 12.38,50.8 12.48,50.9 DELAY_1.11
N$33
  Top 0.254: R2.1 30.7,60.74 31.11,60.33 33.34,60.33 33.66,60.01 MUX_1.13 33.66,57.78
N$41  (via drill 0.6)
  Top 0.254: 1A.P$1 v21.27,62.55 v21.28,62.54 1B.P$2 | 32.38,58.1 MUX_1.14 v32.38,55.88
  Bottom 0.254: v21.27,62.55 27.94,55.88 v32.38,55.88
N$42  (via drill 0.6)
  Top 0.254: 1A.P$3 v20.32,61.28 v20.32,61.27 1B.P$4 | MUX_1.1 v29.84,53.98
  Bottom 0.254: v20.32,61.28 20.95,61.28 28.26,53.98 v29.84,53.98
N$43  (via drill 0.6)
  Top 0.254: 1A.P$5 v20.95,60.01 v20.96,60 1B.P$6 | v33.97,53.98 34.61,53.98 34.92,53.66 MUX_1.5 34.92,51.75
  Bottom 0.254: v20.95,60.01 27.94,53.02 | 27.94,53.02 31.37,53.02 | 27.94,53.02 31.43,53.02 32.38,53.98 v33.97,53.98
N$44
  Top 0.254: 1A.P$7 20.64,58.73 | 20.64,58.73 21.59,57.78 25.4,57.78 26.99,56.2 30.8,56.2 31.11,56.52 MUX_1.15 31.11,58.1 | 20.64,58.73 1B.P$8 | 20.64,58.73 20.64,58.74
N$51
  Top 0.305: MUX_1.3 32.38,50.16 33.53,49.02 36.58,49.02 | U$6.SIG 41.91,51.56 39.37,49.02 36.58,49.02 | C27.1 36.62,48.73 36.58,49.02
N$55
  Top 0.254: 25.68,50.48 25.72,50.48 | 25.68,50.48 R6.1 25.56,51.6 26.04,52.07 27.94,52.07 28.57,52.7 28.57,54.61 28.89,54.93 30.8,54.93 31.11,54.61 MUX_1.2 | R7.1 23.64,50.48 25.68,50.48
RAW
  Top 0.61: JP3.1 38.72,20.32 38,19.6 38,18.8 36,16.8 36,11.6 36.17,11.43 U$1.P$1 36.97,11.43 41.6,6.8 41.6,4 D1.1
SOUND
  Top 0.305: JP6.1 36.85,33 39,33 39.6,32.4 39.6,30.6 39.8,30.4 41.83,30.4 U$5.SIG
VCC  (via drill 0.51, 0.6)
  Top 0.254: 1B.P$3 27.3,61.27 27.62,61.59 28.89,61.59 | R2.2 29,60.22 29.84,59.37 MUX_1.16 29.84,57.47 | C10.1 11.94,46.1 11.94,48.01 DELAY_1.14 13.97,48.26 v15.24,46.74 15.37,46.86 | PROG.2 22.08,4.32 21.8,4.6 8.7,4.6 7.9,5.4 7.9,7.6 7.96,7.54 R1.2
  Top 0.305: 27.52,48.58 27.43,48.66 27.43,48.77 27.43,49.53 R6.2 | R3.2 27.26,52.98 26.99,52.7 24.45,52.7 v24.13,52.39 | 27.52,48.58 27.3,48.58 | 27.52,48.58 v24.45,48.58 | 1B.P$3 26.16,61.09 26.04,60.96 | 1B.P$3 1B.P$1 | 1B.P$3 26.16,60.14 26.04,60.01 26.04,60 1B.P$5 26.16,58.92 26.35,58.74 26.35,58.73 1B.P$7 | 33.02,63.18 29.21,63.18 28.89,62.87 28.89,61.59 R2.2 | 27.43,42.42 21.59,42.42 21.2,42 IC1.18 21.2,38.8 21,38.6 19.8,38.6 19.6,38.8 IC1.20 | IC1.6 20.4,31.6 | IC1.4 18.8,30.2 19.2,29.8 | 19.2,29.8 20,29.8 20.4,30.2 IC1.6 | IC1.6 20.4,31.8 | 19.2,28.2 19.2,27.2 18.8,26.8 15.4,26.8 12.6,24 v12.6,21.8 | 19.2,28.2 19.2,29.8 | 24.4,19.6 v21.9,19.6 | C3.1 18.02,28.2 19.2,28.2 | 23.49,13.09 C19.A | C18.1 | v21.2,14 21.28,13.92 | 8,7.4 7.96,7.44 R1.2 | 7.9,7.6 7.88,7.62 6.99,7.62 6.35,8.26 6.35,15.24 5.71,15.88 JP2.4
  Top 0.406: R18.2 30.06,10.06 30,10 30,11.6 30.48,12.08 IC3.2 30.48,15.52 30,16 26.8,16 | 26.8,16 26.4,15.6 26.4,13.6 26,13.2 24.8,13.2 24.77,13.23 C19.A | 26.8,16 26.8,17.6 26.4,18 24.8,18 24.4,18.4 24.4,19.6 24.4,25.2 25.23,26.04 R17.2 26.84,26.04 | 29.84,40.64 29.6,40.4 29.6,28.4 29.2,28 28,28 27.2,27.2 27.2,26.4 26.84,26.04 | 29.84,40.64 30.48,41.28 LED2.A 27.43,42.42 27.43,48.77 | 26.84,26.04 26.8,26 | C13.1 32.8,62.97 33.02,63.18 v33.34,63.5 | 29.84,40.64 v34.61,40.64 | 23.49,13.09 22.8,12.4 21.4,12.4 C18.1 21.28,13.92
  Bottom 0.254: v15.24,46.74 22.35,46.74 24,48.39 v24.45,48.58
  Bottom 0.305: v24.13,52.39 24.13,48.9 v24.45,48.58 | v12.6,21.8 14.8,19.6 v21.9,19.6
  Bottom 0.406: v33.34,63.5 40.96,63.5 49.21,55.24 49.21,48.9 42.55,42.23 36.2,42.23 v34.61,40.64 | v21.2,14 15,14 14.97,13.97 7.62,13.97 5.71,15.88 JP2.4 JP2.5 JP2.6
VIN
  Top 0.61: D1.2 34.02,3.98 33.6,4.4 32.4,4.4 32.35,4.45 C11.+ 32.26,4.66 32.79,5.19 IC3.3
(copper drawn outside any net)
  shapes: Top area x1

### Text on the board
tPlace: www.critterandguitar.com | C3 | C4 | C5 | AD6 | v01 | AD7 | D0 | D1 | STAT | D2 | D3 | D4 | D6 | D7 | B0 | B2 | PWR | Vin | Vcc | Vcc | GND | RST | Vcc | video critter mini | GND | GND | GND | 9VDC | ICSP